# Altium schematic sheet ADC-RDC-IO.SchDoc
size A4
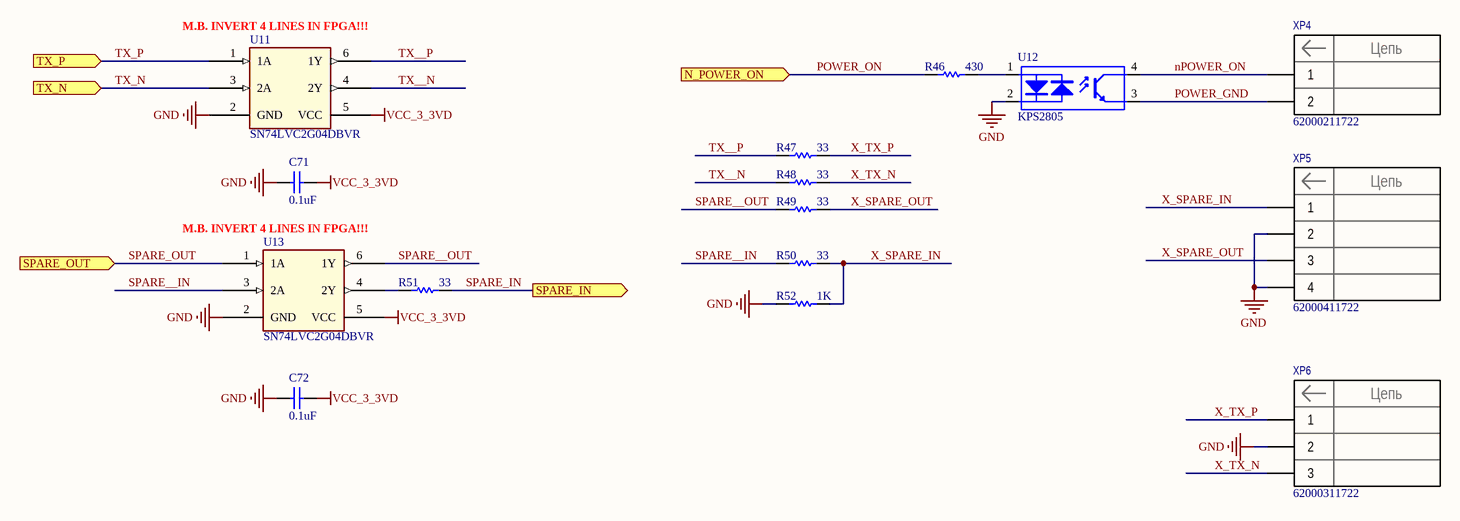
[diagram p0: ADC-RDC-IO.SchDoc]

## Parts
C71  0.1uF  [C0603]
C72  0.1uF  [C0603]
R46  430  [R0603]
R47  33  [R0603]
R48  33  [R0603]
R49  33  [R0603]
R50  33  [R0603]
R51  33  [R0603]
R52  1K  [R0603]
U11  SN74LVC2G04DBVR  [SOT23-6]
U12  KPS2805  [SOP4]
U13  SN74LVC2G04DBVR  [SOT23-6]
XP4  Component_name: 62000211722  [conP_WR-WTB_62000211722-2pin_P2000_60x76x48_L]  (hidden comment: plug_62000211722_WR-WTB_2pin_horiz)
XP5  Component_name: 62000411722  [conP_WR-WTB_62000411722-4pin_P2000_100x76x48_L]  (hidden comment: plug_62000411722_WR-WTB_4pin_horiz)
XP6  Component_name: 62000311722  [conP_WR-WTB_62000311722-3pin_P2000_80x76x48_L]  (hidden comment: plug_62000311722_WR-WTB_3pin_horiz)

## Ports
N_POWER_ON (in), SPARE_IN (out), SPARE_OUT (in), TX_N (in), TX_P (in)

## Nets
GND: C71.1 C72.1 R52.1 U11.2(GND) U12.2(K) U13.2(GND) XP5.2 XP5.4 XP6.2
VCC_3_3VD: C71.2 C72.2 U11.5(VCC) U13.5(VCC)
POWER_GND: U12.3(E) XP4.2
POWER_ON: R46.1 ; port N_POWER_ON
SPARE__IN: R50.1 U13.3(2A)
SPARE__OUT: R49.1 U13.6(1Y)
SPARE_IN: R51.2 ; port SPARE_IN
SPARE_OUT: U13.1(1A) ; port SPARE_OUT
TX__N: R48.1 U11.4(2Y)
TX__P: R47.1 U11.6(1Y)
TX_N: U11.3(2A) ; port TX_N
TX_P: U11.1(1A) ; port TX_P
X_SPARE_IN: R50.2 R52.2 XP5.1
X_SPARE_OUT: R49.2 XP5.3
X_TX_N: R48.2 XP6.3
X_TX_P: R47.2 XP6.1
NetR46_2: R46.2 U12.1(A)
NetR51_1: R51.1 U13.4(2Y)
NetU12_4: U12.4(C) XP4.1

## Notes on the sheet
- (near U11) M.B. INVERT 4 LINES IN FPGA!!!
- M.B. INVERT 4 LINES IN FPGA!!!
- Labels drawn without touching a wire or pin: nPOWER_ON
- (in symbol plug_62000211722_WR-WTB_2pin_horiz) Цепь
- (in symbol plug_62000311722_WR-WTB_3pin_horiz) Цепь
- (in symbol plug_62000411722_WR-WTB_4pin_horiz) Цепь

## Library data of the parts
C71 C72 = Cap: Capacitor, 2pin; ValueSCH: *; ValueBOM: *; MarkPCB: *
R46-R52 = RES: Resistor, 2pin; ValueSCH: *; ValueBOM: *; MarkPCB: *
U11 U13 = SN74LVC2G04DBVR: DUAL INVERTER GATE; ValueBOM: *; ValueSCH: *; MarkPCB: *
U12 = Optoisolator: Phototransistor Optocoupler, 4-Pin; ValueSCH: *; ValueBOM: *; MarkPCB: *
XP4 = plug_62000211722_WR-WTB_2pin_horiz: 2.00mm Male Horizontal Shrouded Header WR-WTB; Part_number_PROSA: D-VI-6267; Manufacturer: "Wurth Elektronik"; LxWxH(mm): 6,0x7,6x4,8; Area(mm2): 45,6; Number_of_pads: 2; Mounting_type: Standard; Component_ID: plug_62000211722_WR-WTB_2pin_horiz; Component Class: Plug_PCB_mounting; Type: Вилки; PROSA_name (Old name): 62000211722; Package: conP_WR-WTB_62000211722-2pin_P2000_60x76x48; Case_code: WR-WTB_2pin_horiz; Height(mm): 4,8; ComponentLink1Description: plug_62000211722.pdf; ComponentLink1URL: C:\chkout_AltiumLib\Datasheets\Electromechanics_datasheet\Connectors\plug_62000211722.pdf; HelpURL: C:\chkout_AltiumLib\Datasheets\Electromechanics_datasheet\Connectors\plug_62000211722.pdf; ComponentLink2Description: plug_62000211722_URL_Link; ComponentLink2URL: http://katalog.we-online.com/en/em/WTB_2_00_MALE_HORIZONTAL_SHROUDED_HEADER_6200XX11722/62000211722?sid=a40b27176d
XP5 = plug_62000411722_WR-WTB_4pin_horiz: 2.00mm Male Vertical Shrouded Header WR-WTB; Part_number_PROSA: D-VI-6034; Manufacturer: "Wurth Elektronik"; LxWxH(mm): 10,0x7,6x4,8; Area(mm2): 76; Number_of_pads: 4; Mounting_type: Standard; Component_ID: plug_62000411722_WR-WTB_4pin_horiz; Component Class: Plug_PCB_mounting; Type: Вилки; PROSA_name (Old name): 62000411722; Package: conP_WR-WTB_62000411722-4pin_P2000_100x76x48; Case_code: WR-WTB_4pin_horiz; Height(mm): 4,8; ComponentLink1Description: plug_62000411722.pdf; ComponentLink1URL: C:\chkout_AltiumLib\Datasheets\Electromechanics_datasheet\Connectors\plug_62000411722.pdf; HelpURL: C:\chkout_AltiumLib\Datasheets\Electromechanics_datasheet\Connectors\plug_62000411722.pdf; ComponentLink2Description: plug_62000411722_URL_Link; ComponentLink2URL: http://katalog.we-online.de/en/em/WTB_2_00_MALE_VERTICAL_SHROUDED_HEADER_6200XX11622
XP6 = plug_62000311722_WR-WTB_3pin_horiz: 2.00mm Male Vertical Shrouded Header WR-WTB; Part_number_PROSA: D-VI-6523; Manufacturer: "Wurth Elektronik"; LxWxH(mm): 8,0x7,6x4,8; Area(mm2): 60,8; Number_of_pads: 3; Mounting_type: Standard; Component_ID: plug_62000311722_WR-WTB_3pin_horiz; Component Class: Plug_PCB_mounting; Type: Вилки; PROSA_name (Old name): 62000311722; Package: conP_WR-WTB_62000311722-3pin_P2000_80x76x48; Case_code: WR-WTB_3pin_horiz; Height(mm): 4,8; ComponentLink1Description: plug_62000311722.pdf; ComponentLink1URL: C:\chkout_AltiumLib\Datasheets\Electromechanics_datasheet\Connectors\plug_62000311722.pdf; HelpURL: C:\chkout_AltiumLib\Datasheets\Electromechanics_datasheet\Connectors\plug_62000311722.pdf; ComponentLink2Description: plug_62000311722_URL_Link; ComponentLink2URL: http://katalog.we-online.de/en/em/WTB_2_00_MALE_VERTICAL_SHROUDED_HEADER_6200XX11622